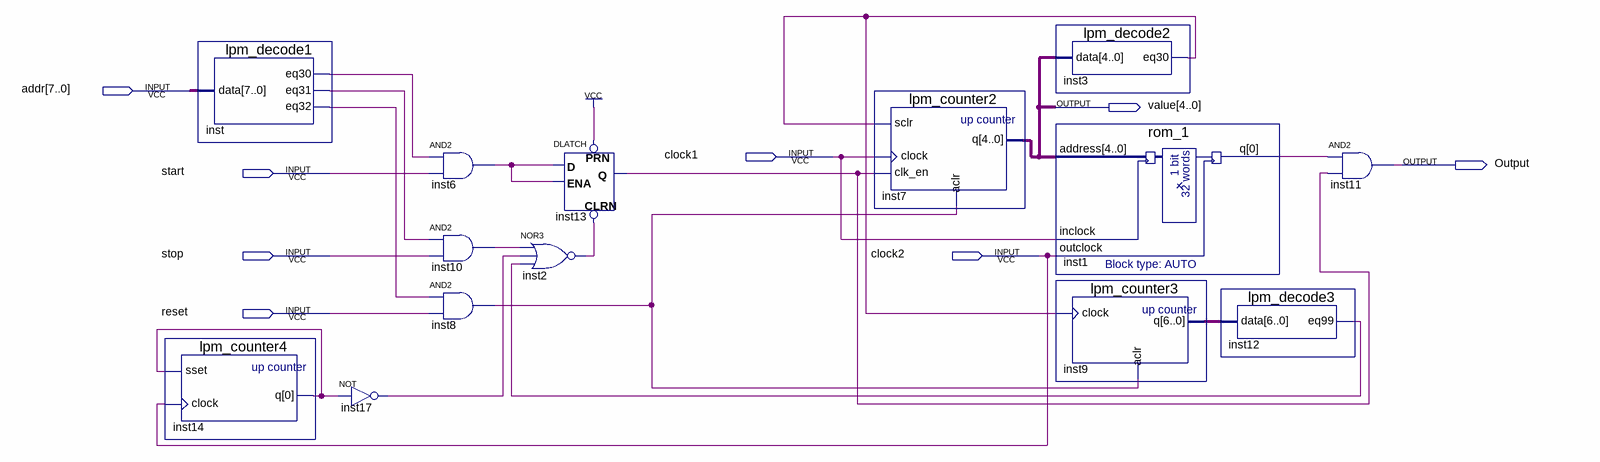
[diagram p0: schematic sheet]
// Quartus schematic kursach.bdf as structural Verilog: 14 symbols, 8 pins
module kursach (
  input  [7:0] addr,
  input  clock1,
  input  start,
  input  stop,
  input  clock2,
  input  reset,
  output [4:0] value,
  output Output
);

  wire inst1_q, inst2_out, inst3_eq30, inst6_out, inst8_out, inst10_out, inst12_eq99, inst13_q, inst14_q,
       inst17_out, inst_eq30, inst_eq31, inst_eq32;
  wire [6:0] inst9_q;

  lpm_counter4 inst14 (.sset(inst14_q), .clock(clock2), .q(inst14_q));
  lpm_decode1 inst (.data(addr), .eq30(inst_eq30), .eq31(inst_eq31), .eq32(inst_eq32));
  not inst17 (inst17_out, inst14_q);
  and inst6 (inst6_out, inst_eq30, start);
  and inst10 (inst10_out, inst_eq31, stop);
  and inst8 (inst8_out, inst_eq32, reset);
  nor inst2 (inst2_out, inst10_out, inst17_out, inst12_eq99);
  DLATCH inst13 (.CLRN(inst2_out), .D(inst6_out), .ENA(inst6_out), .PRN(1'b1), .Q(inst13_q));
  lpm_counter2 inst7 (.sclr(inst3_eq30), .clock(clock1), .clk_en(inst13_q), .aclr(inst8_out), .q(value));
  lpm_decode2 inst3 (.data(value), .eq30(inst3_eq30));
  rom_1 inst1 (.address(value), .inclock(clock1), .outclock(clock2), .q(inst1_q));
  lpm_counter3 inst9 (.clock(inst3_eq30), .aclr(inst8_out), .q(inst9_q));
  lpm_decode3 inst12 (.data(inst9_q), .eq99(inst12_eq99));
  and inst11 (Output, inst1_q, inst13_q);
endmodule
